# EAGLE schematic breakout v1.0 (EAGLE 7.2.0)
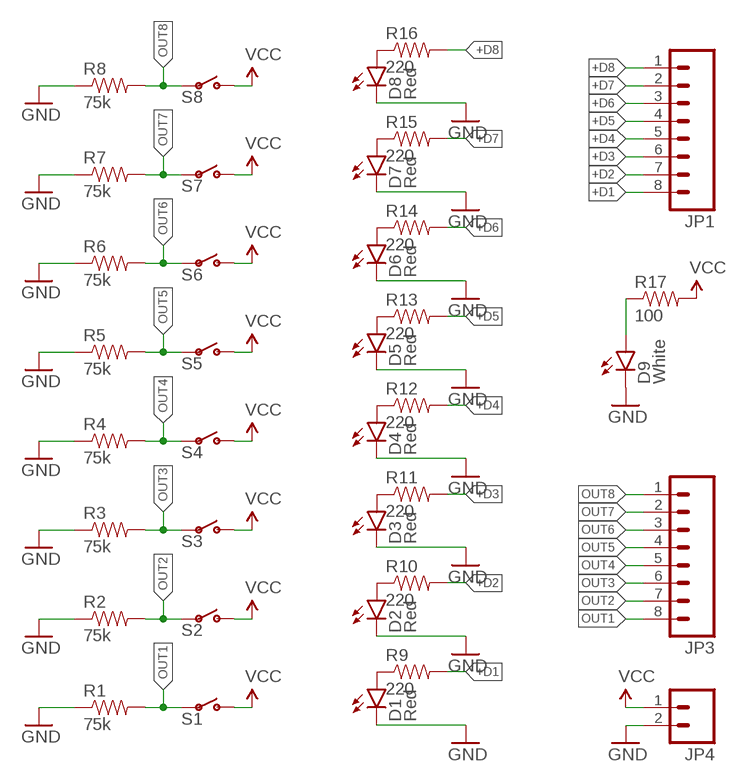
[diagram p0: schematic, sheet 1]

## Parts
D1  Red  LED0805  [0805]
D2  Red  LED0805  [0805]
D3  Red  LED0805  [0805]
D4  Red  LED0805  [0805]
D5  Red  LED0805  [0805]
D6  Red  LED0805  [0805]
D7  Red  LED0805  [0805]
D8  Red  LED0805  [0805]
D9  White  LED0603  [LED-0603]
JP1  M08  [1X08_ROUND]
JP3  M08  [1X08_ROUND]
JP4  M02PTH  [1X02]
R1  75k  RESISTOR0603  [0603-RES]
R2  75k  RESISTOR0603  [0603-RES]
R3  75k  RESISTOR0603  [0603-RES]
R4  75k  RESISTOR0603  [0603-RES]
R5  75k  RESISTOR0603  [0603-RES]
R6  75k  RESISTOR0603  [0603-RES]
R7  75k  RESISTOR0603  [0603-RES]
R8  75k  RESISTOR0603  [0603-RES]
R9  220  RESISTOR0603  [0603-RES]
R10  220  RESISTOR0603  [0603-RES]
R11  220  RESISTOR0603  [0603-RES]
R12  220  RESISTOR0603  [0603-RES]
R13  220  RESISTOR0603  [0603-RES]
R14  220  RESISTOR0603  [0603-RES]
R15  220  RESISTOR0603  [0603-RES]
R16  220  RESISTOR0603  [0603-RES]
R17  100  RESISTOR0603  [0603-RES]
S1  SWITCH_SPSTSMD  [5.2X5.2X1.5-SMD]
S2  SWITCH_SPSTSMD  [5.2X5.2X1.5-SMD]
S3  SWITCH_SPSTSMD  [5.2X5.2X1.5-SMD]
S4  SWITCH_SPSTSMD  [5.2X5.2X1.5-SMD]
S5  SWITCH_SPSTSMD  [5.2X5.2X1.5-SMD]
S6  SWITCH_SPSTSMD  [5.2X5.2X1.5-SMD]
S7  SWITCH_SPSTSMD  [5.2X5.2X1.5-SMD]
S8  SWITCH_SPSTSMD  [5.2X5.2X1.5-SMD]

## Nets
+D1: JP1.8 R9.2
+D2: JP1.7 R10.2
+D3: JP1.6 R11.2
+D4: JP1.5 R12.2
+D5: JP1.4 R13.2
+D6: JP1.3 R14.2
+D7: JP1.2 R15.2
+D8: JP1.1 R16.2
GND: D1.2(C) D2.2(C) D3.2(C) D4.2(C) D5.2(C) D6.2(C) D7.2(C) D8.2(C) D9.C JP4.2 R1.1 R2.1 R3.1 R4.1 R5.1 R6.1 R7.1 R8.1
N$1: D1.1(A) R9.1
N$2: D2.1(A) R10.1
N$3: D3.1(A) R11.1
N$4: D4.1(A) R12.1
N$5: D5.1(A) R13.1
N$6: D6.1(A) R14.1
N$7: D7.1(A) R15.1
N$8: D8.1(A) R16.1
N$9: D9.A R17.1
OUT1: JP3.8 R1.2 S1.P$3
OUT2: JP3.7 R2.2 S2.P$3
OUT3: JP3.6 R3.2 S3.P$3
OUT4: JP3.5 R4.2 S4.P$3
OUT5: JP3.4 R5.2 S5.P$3
OUT6: JP3.3 R6.2 S6.P$3
OUT7: JP3.2 R7.2 S7.P$3
OUT8: JP3.1 R8.2 S8.P$3
VCC: JP4.1 R17.2 S1.P$1 S2.P$1 S3.P$1 S4.P$1 S5.P$1 S6.P$1 S7.P$1 S8.P$1

## Library data of the parts
D1-D9 = Charlie-LED:LED: LEDs Standard schematic elements and footprints for 5mm, 3mm, 1206, and 0603 sized LEDs.
JP1 JP3 = SparkFun-Connectors:M08: Header 8 Standard 8-pin 0.1" header. Use with straight break away headers (SKU : PRT-00116), right angle break away headers (PRT-00553), swiss pins (PRT-00743), machine pins (PRT-00117), and female headers (PRT-00115).
JP4 = SparkFun-Connectors:M02: Standard 2-pin 0.1" header. Use with - straight break away headers ( PRT-00116) - right angle break away headers (PRT-00553) - swiss pins (PRT-00743) - machine pins (PRT-00117) - female headers (PRT-00115) Molex polarized connector foot print use with: PRT-08233 with associated crimp pins and housings. 2.54_SCREWTERM for use with PRT-10571. 3.5mm Screw Terminal footprints for PRT-08084 5mm Screw Terminal footprints for use with PRT-08432
R1-R17 = Charlie-Resistances:RESISTOR: Resistor Basic schematic elements and footprints for 0603, 1206, and PTH resistors.
S1-S8 = Charlie-Switch:SWITCH_SPST